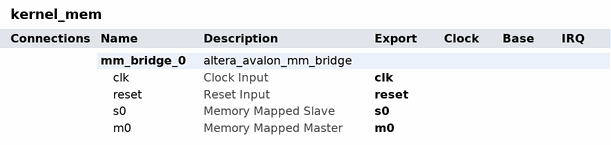
[diagram p0: system contents]
# Platform Designer (Qsys) system kernel_mem, Arria 10 10AXF40AA
# Parameters at their usual value, and those the tool derives, are not listed.
package require -exact qsys 1.0
create_system kernel_mem
set_project_property DEVICE_FAMILY {Arria 10}
set_project_property DEVICE 10AXF40AA

add_component mm_bridge_0 ip/kernel_mem/kernel_mem_mm_bridge_0.ip altera_avalon_mm_bridge mm_bridge_0 18.1
load_component mm_bridge_0
set_component_parameter_value DATA_WIDTH 512
set_component_parameter_value ADDRESS_WIDTH 31
set_component_parameter_value USE_AUTO_ADDRESS_WIDTH 0
set_component_parameter_value ADDRESS_UNITS SYMBOLS
set_component_parameter_value MAX_BURST_SIZE 16
set_component_parameter_value MAX_PENDING_RESPONSES 64
set_component_parameter_value SYNC_RESET 0
save_component

# exported interfaces
add_interface clk clock sink
set_interface_property clk EXPORT_OF mm_bridge_0.clk
add_interface m0 avalon master
set_interface_property m0 EXPORT_OF mm_bridge_0.m0
add_interface reset reset sink
set_interface_property reset EXPORT_OF mm_bridge_0.reset
add_interface s0 avalon slave
set_interface_property s0 EXPORT_OF mm_bridge_0.s0

set_interconnect_requirement {$system} qsys_mm.clockCrossingAdapter HANDSHAKE
set_interconnect_requirement {$system} qsys_mm.enableEccProtection FALSE
set_interconnect_requirement {$system} qsys_mm.insertDefaultSlave FALSE
set_interconnect_requirement {$system} qsys_mm.maxAdditionalLatency 1

save_system kernel_mem.qsys
